# Altium schematic sheet Power Supply.SchDoc
size B; SheetNumber: 2; SheetTotal: 7; SPICEModelCacheACFILVDY: <root> / <DocumentId>ACFILVDY</DocumentId> / <CacheFrame Number="0"> / <Model Name="0603_150060bs75000" Kind="CKT"> / <Text>****** / .subckt 0603_150060BS75000  1  2 / D1 1 2 SMCW / .MODEL SMCW D / + IS=316.72E-15 / + N=3.9746 / + RS=1.2476 / + IKF=130.15E-6 / + CJO=1.0000E-12 / + M=.3333 / + VJ=.75 / + BV=5 / + IBV=10.00E-6 / + TT=5.0000E-9 / .ends</Text> / </Model> / </CacheFrame> / </root>
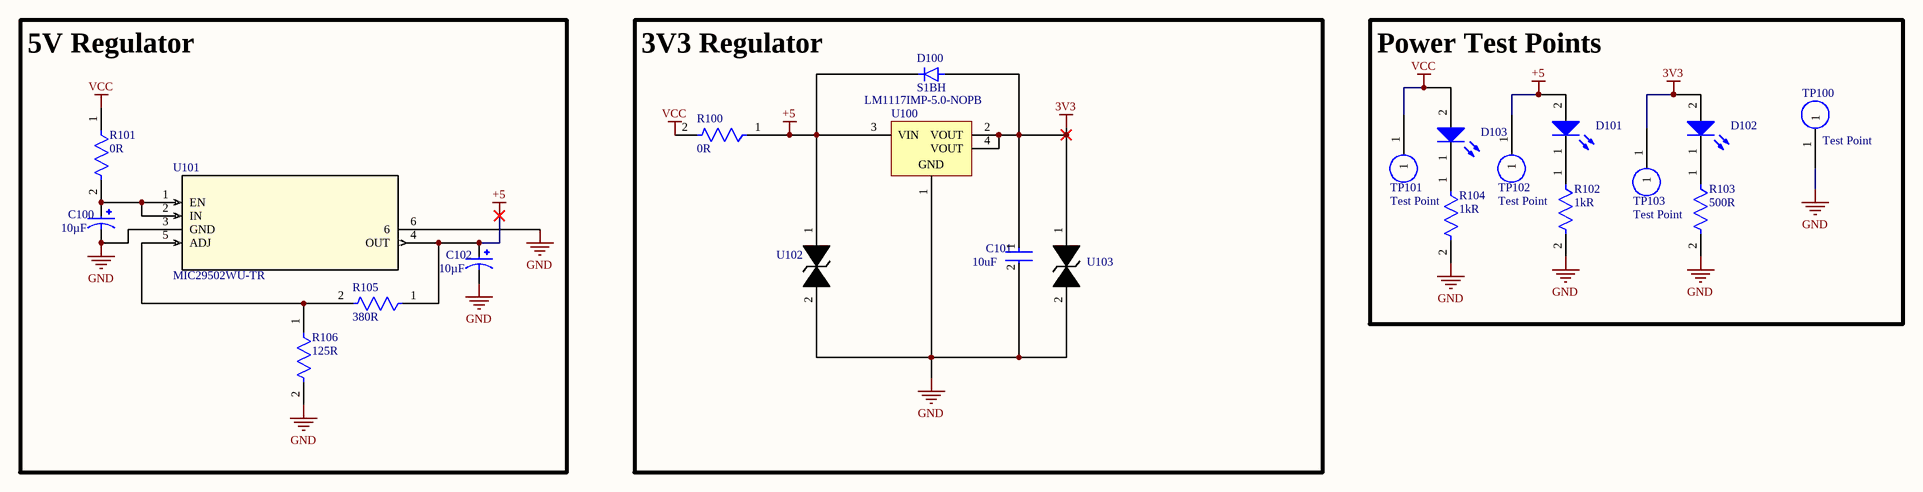
[diagram p0: Power Supply.SchDoc]

## Parts
C100  value 10µF  [CAP_EEEFN1C100R]  (hidden comment: EEEFN1C100R)
C101  Capacitance: 10uF  [FP-GRM21B-0_15-IPC_C]  (hidden comment: GRM21BR61E106KA73L)
C102  value 10µF  [CAP_EEEFN1C100R]  (hidden comment: EEEFN1C100R)
D100  S1BH  [DIOM4325X250N]
D101  150060BS75000  [WL-SMCW_0603_150060xx75000]  (value not drawn)
D102  150060BS75000  [WL-SMCW_0603_150060xx75000]  (value not drawn)
D103  150060BS75000  [WL-SMCW_0603_150060xx75000]  (value not drawn)
R100  value 0R  [FP-CPF0603-MFG]  (hidden comment: CPF0603B2K15E1)
R101  value 0R  [FP-CPF0603-MFG]  (hidden comment: CPF0603B2K15E1)
R102  value 1kR  [FP-CPF0603-MFG]  (hidden comment: CPF0603B2K15E1)
R103  value 500R  [FP-CPF0603-MFG]  (hidden comment: CPF0603B2K15E1)
R104  value 1kR  [FP-CPF0603-MFG]  (hidden comment: CPF0603B2K15E1)
R105  value 380R  [FP-CPF0603-MFG]  (hidden comment: CPF0603B2K15E1)
R106  value 125R  [FP-CPF0603-MFG]  (hidden comment: CPF0603B2K15E1)
TP100  Test Point  [2mm TP]
TP101  Test Point  [2mm TP]
TP102  Test Point  [2mm TP]
TP103  Test Point  [2mm TP]
U100  LM1117IMP-5.0-NOPB  [DCY0004A_M]
U101  MIC29502WU-TR  [TO-263-5_MCH]
U102  SP1003-01ETG  [SP1003-01ETG_LTF]  (value not drawn)
U103  SP1003-01ETG  [SP1003-01ETG_LTF]  (value not drawn)

## Blocks framed on the sheet
5V Regulator: C100 C102 R101 R105 R106 U101
3V3 Regulator: C101 D100 R100 U100 U102 U103
Power Test Points: D101-D103 R102-R104 TP100-TP103

## Nets
3V3: C101.1 D100.A D102.2(A) TP103.1 U100.2(VOUT) U100.4(VOUT) U103.1
+5: C102.1 D100.C(K) D101.2(A) R100.1 R105.1 TP102.1 U100.3(VIN) U101.4(OUT) U102.1
GND: C100.2 C101.2 C102.2 R102.2 R103.2 R104.2 R106.2 TP100.1 U100.1(GND) U101.3(GND) U101.6 U102.2 U103.2
VCC: D103.2(A) R100.2 R101.1 TP101.1
NetC100_1: C100.1 R101.2 U101.1(EN) U101.2(IN)
NetD101_1: D101.1(K) R102.1
NetD102_1: D102.1(K) R103.1
NetD103_1: D103.1(K) R104.1
NetR105_2: R105.2 R106.1 U101.5(ADJ)

## Library data of the parts
C100 C102 = CMP-001-00085-1: 10ÂµF 16V Aluminum Electrolytic Capacitors Radial, Can - SMD 1.35Ohm @ 100kHz 2000 Hrs @ 105Â°C; MF: Panasonic; Digi-Key_Part_Number: 10-EEE-FN1C100RCT-ND; Design Item ID: EEEFN1C100R; Check_prices: https://www.snapeda.com/parts/EEEFN1C100R/Panasonic/view-part/5793981/?ref=eda; MP: EEEFN1C100R; Source: EEEFN1C100R.SchLib; Case/Package: RADIAL-2 Panasonic; Component Type: Standard; Pins: 2; SnapEDA_Link: https://www.snapeda.com/parts/EEEFN1C100R/Panasonic/view-part/5793981/?ref=snap
C101 = CMP-2007-03541-2: Chip Multilayer Ceramic Capacitors for General Purpose, 0805, 10uF, X5R, 15%, 10%, 25V; Length: 2mm; Depth: 1.25mm; Termination: SMD/SMT; Voltage: 25V; Height: 1.25mm; Material: Ceramic; Thickness: 0.053inch; Radiation Hardening: No; Min Operating Temperature: -55°C; Width: 0.049inch; Package Quantity: 1; Mount: Surface Mount; Dielectric: X5R; Packaging: Tape and Reel; Voltage Rating (DC): 25V; Lead Free: Lead Free; Max Operating Temperature: 85°C; Case Code (Imperial): 0805; Case/Package: 0805; Tolerance: 10%; Voltage Rating: 25V; Case Code (Metric): 2012
D100 = CMP-004-00033-1: Case/Package: None; Design Item ID: S1BH; Component Type: Standard; Availability: Unavailable; Price: None; Source: S1BH.SchLib; Value: *; Pins: 2; MP: S1BH
D101-D103 = CMP-004-00039-1: WL-SMCW Mono-color Chip LED Waterclear, SMT, size 0603, Blue, 3.2V, 140°; Manufacturer: Wurth Elektronik; Dominant Wavelength: 470nm; Luminous Intensity: 145mcd; Peak Wavelength: 465nm; Chip Technology: InGaN; Mount: Surface Mount; Viewing Angle: 140°; Component Type: Standard; Match Code: WL-SMCW; Emitting Color: Blue; Length: 1.6mm; ComponentLink1URL: https://www.we-online.com/redexpert/article/150060BS75000?ad; Design Item ID: 150060BS75000; ComponentLink2Description: Datasheet Link; ComponentLink2URL: https://www.we-online.com/redexpert/spec/150060BS75000?ad; Width: 0.8mm; Case/Package: 0603; Manufacturer Part Number: 150060BS75000; Forward Voltage: 3.2V; Source: WL-SMCW.SchLib; Category: Signal LEDs; Operating Temperature Min: -40°C; Pins: 2; ComponentLink1Description: Website Link; Height: 0.7mm; Operating Temperature Max: 85°C; Packaging: Tape and Reel
R100-R106 = CMP-03211-008657-1: RES SMD 2.15KΩ 0.1% 1/16W 0603; Manufacturer: TE Connectivity; Temperature Coefficient: 25ppm/°C; Voltage Rating: 50V; Power Rating: 0.063W; Height: 0.55mm; Series: CPF; ComponentLink2Description: Datasheet; Package: CPF0603; Automotive: No; octopart_url: https://octopart.com/cpf0603b2k15e1-te+connectivity-22739551; Lead Free: Yes; Temperature: -55°C to +155°C; RoHS: TRUE; Ipc Land Pattern Name: RESC15580X45; Temperature Range Low: -55°C; Composition: Thin Film; Device Class L3: Chip SMD Resistors; Category: Res; Octopart: https://octopart.com/cpf0603b2k15e1-te+connectivity-22739551; Resistance: 2.15KΩ; ComponentLink2URL: https://www.te.com/commerce/DocumentDelivery/DDEController?Action=showdoc&DocId=Data+Sheet%7F1773200%7FM%7Fpdf%7FEnglish%7FENG_DS_1773200_M.pdf%7F3-1676481-2; Manufacturer Part Number: CPF0603B2K15E1; packaging: 1k Reel; Tolerance: 0.1%; Temperature Range High: +155°C; Device Class L1: Passive Components; Device Class L2: Resistors
TP101 = CMP-096-000000-1: Source: Test_Points.SchLib; Design Item ID: Test Point
U100 = CMP-019-00021-3: Low-Dropout Linear Regulator, 800 mA, -40 to 125 degC, 4-Pin SOT-223 (DCY), Green (RoHS & no Sb/Br), Tape and Reel; Manufacturer: Texas Instruments; Dropout Voltage: 1.2V; Nominal Output Voltage: 5V; Max Ouput Current: 800mA; Outputs: 1; Min Input Voltage: 2.6V; Max Input Voltage: 15V; Manufacturer URL: http://www.ti.com/; Max Operating Temperature: 125°C; Packaging: TapeandReel; RoHS Compliant: True; Output Voltage: 5V; Pins: 4; Package Description: 4-Pin Small Outline Transistor, Body 6.5 x 3.5 mm, Pitch 2.3 mm; Min Operating Temperature: -40°C; Mounting Technology: SM; Output Current: 800mA; Case/Package: SOT-223; Datasheet Version: SNOS412N, 01/2016; Datasheet URL: http://www.ti.com/lit/ds/symlink/lm1117.pdf; Package Reference: DCY0004A
U101 = CMP-098-000000-1: No Description Available; Mfr_Name: Microchip; Type: Type; RefDes: RefDes; Design Item ID: MIC29502WU-TR; Source: MIC29502WU-TR.SchLib
U102 U103 = CMP-104-000000-3: No Description Available; Mfr_Name: Littelfuse Inc; Source: SP1003-01ETG.SchLib; Design Item ID: SP1003-01ETG; Type: Type; RefDes: RefDes
TP100 TP102 TP103 = Test Point: Source: Test_Points.SchLib; Design Item ID: Test Point